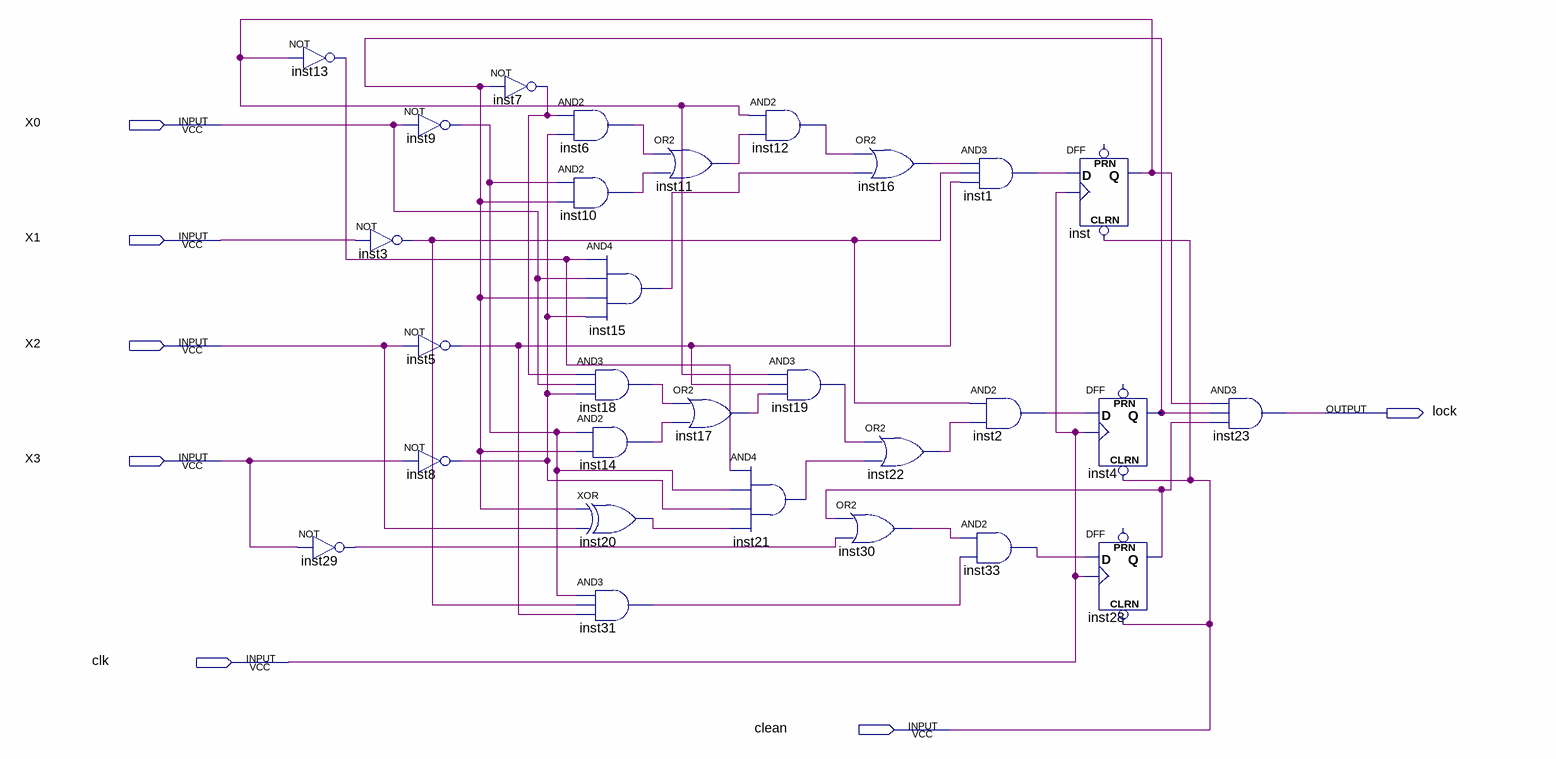
[diagram p0: schematic sheet]
// Quartus schematic Lab02_wave.bdf as structural Verilog: 29 symbols, 7 pins
module Lab02_wave (
  input  X0,
  input  X1,
  input  X2,
  input  X3,
  input  clk,
  input  clean,
  output lock
);

  wire inst1_out, inst2_out, inst3_out, inst4_q, inst5_out, inst6_out, inst7_out, inst8_out, inst9_out,
       inst10_out, inst11_out, inst12_out, inst13_out, inst14_out, inst15_out, inst16_out, inst17_out,
       inst18_out, inst19_out, inst20_out, inst21_out, inst22_out, inst28_q, inst29_out, inst30_out,
       inst31_out, inst33_out, inst_q;

  not inst13 (inst13_out, inst_q);
  not inst29 (inst29_out, X3);
  not inst9 (inst9_out, X0);
  not inst3 (inst3_out, X1);
  not inst5 (inst5_out, X2);
  not inst8 (inst8_out, X3);
  not inst7 (inst7_out, inst4_q);
  and inst6 (inst6_out, inst7_out, inst8_out);
  and inst10 (inst10_out, inst9_out, inst4_q);
  and inst15 (inst15_out, inst13_out, X0, inst4_q, inst8_out);
  and inst18 (inst18_out, inst7_out, X0, inst8_out);
  and inst14 (inst14_out, inst9_out, inst4_q);
  xor inst20 (inst20_out, inst4_q, X2);
  and inst31 (inst31_out, inst9_out, inst3_out, inst5_out);
  or inst11 (inst11_out, inst6_out, inst10_out);
  or inst17 (inst17_out, inst18_out, inst14_out);
  and inst12 (inst12_out, inst_q, inst11_out);
  and inst19 (inst19_out, inst_q, inst5_out, inst17_out);
  and inst21 (inst21_out, inst13_out, inst9_out, inst8_out, inst20_out);
  or inst16 (inst16_out, inst12_out, inst15_out);
  or inst22 (inst22_out, inst19_out, inst21_out);
  or inst30 (inst30_out, inst28_q, inst29_out);
  and inst1 (inst1_out, inst16_out, inst3_out, inst5_out);
  and inst2 (inst2_out, inst3_out, inst22_out);
  and inst33 (inst33_out, inst30_out, inst31_out);
  DFF inst (.CLRN(clean), .CLK(clk), .D(inst1_out), .Q(inst_q));  // open: PRN
  DFF inst4 (.CLRN(clean), .CLK(clk), .D(inst2_out), .Q(inst4_q));  // open: PRN
  DFF inst28 (.CLRN(clean), .CLK(clk), .D(inst33_out), .Q(inst28_q));  // open: PRN
  and inst23 (lock, inst_q, inst4_q, inst28_q);
endmodule
